# EAGLE schematic 2uprava3 (EAGLE 9.5.2)
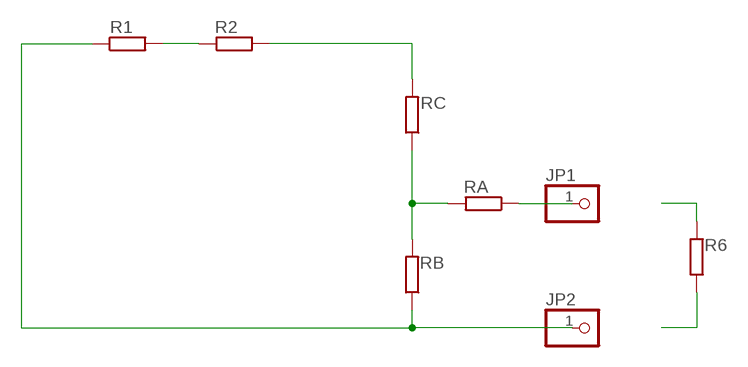
[diagram p0: schematic, sheet 1]

## Parts
JP1  PINHD-1X1  [1X01]
JP2  PINHD-1X1  [1X01]
R1  50R  R-EU_0204/7  [0204/7]
R2  50R  R-EU_0204/7  [0204/7]
R6  200R  R-EU_0204/7  [0204/7]
RA  570R  R-EU_0204/7  [0204/7]
RB  610R  R-EU_0204/7  [0204/7]
RC  220R  R-EU_0204/7  [0204/7]

## Nets
N$2: JP1.1 RA.1
N$3: JP2.1 R1.1 RB.1
N$4: RA.2 RB.2 RC.1
N$5: R2.2 RC.2
N$6: R6.2
N$7: R6.1
N$8: R1.2 R2.1

## Library data of the parts
JP1 JP2 = pinhead:PINHD-1X1: PIN HEADER
R1 R2 R6 RA RB RC = rcl:R-EU_: RESISTOR, European symbol; SPICEPREFIX: R